# Altium schematic sheet USBDAC.SchDoc
size A3
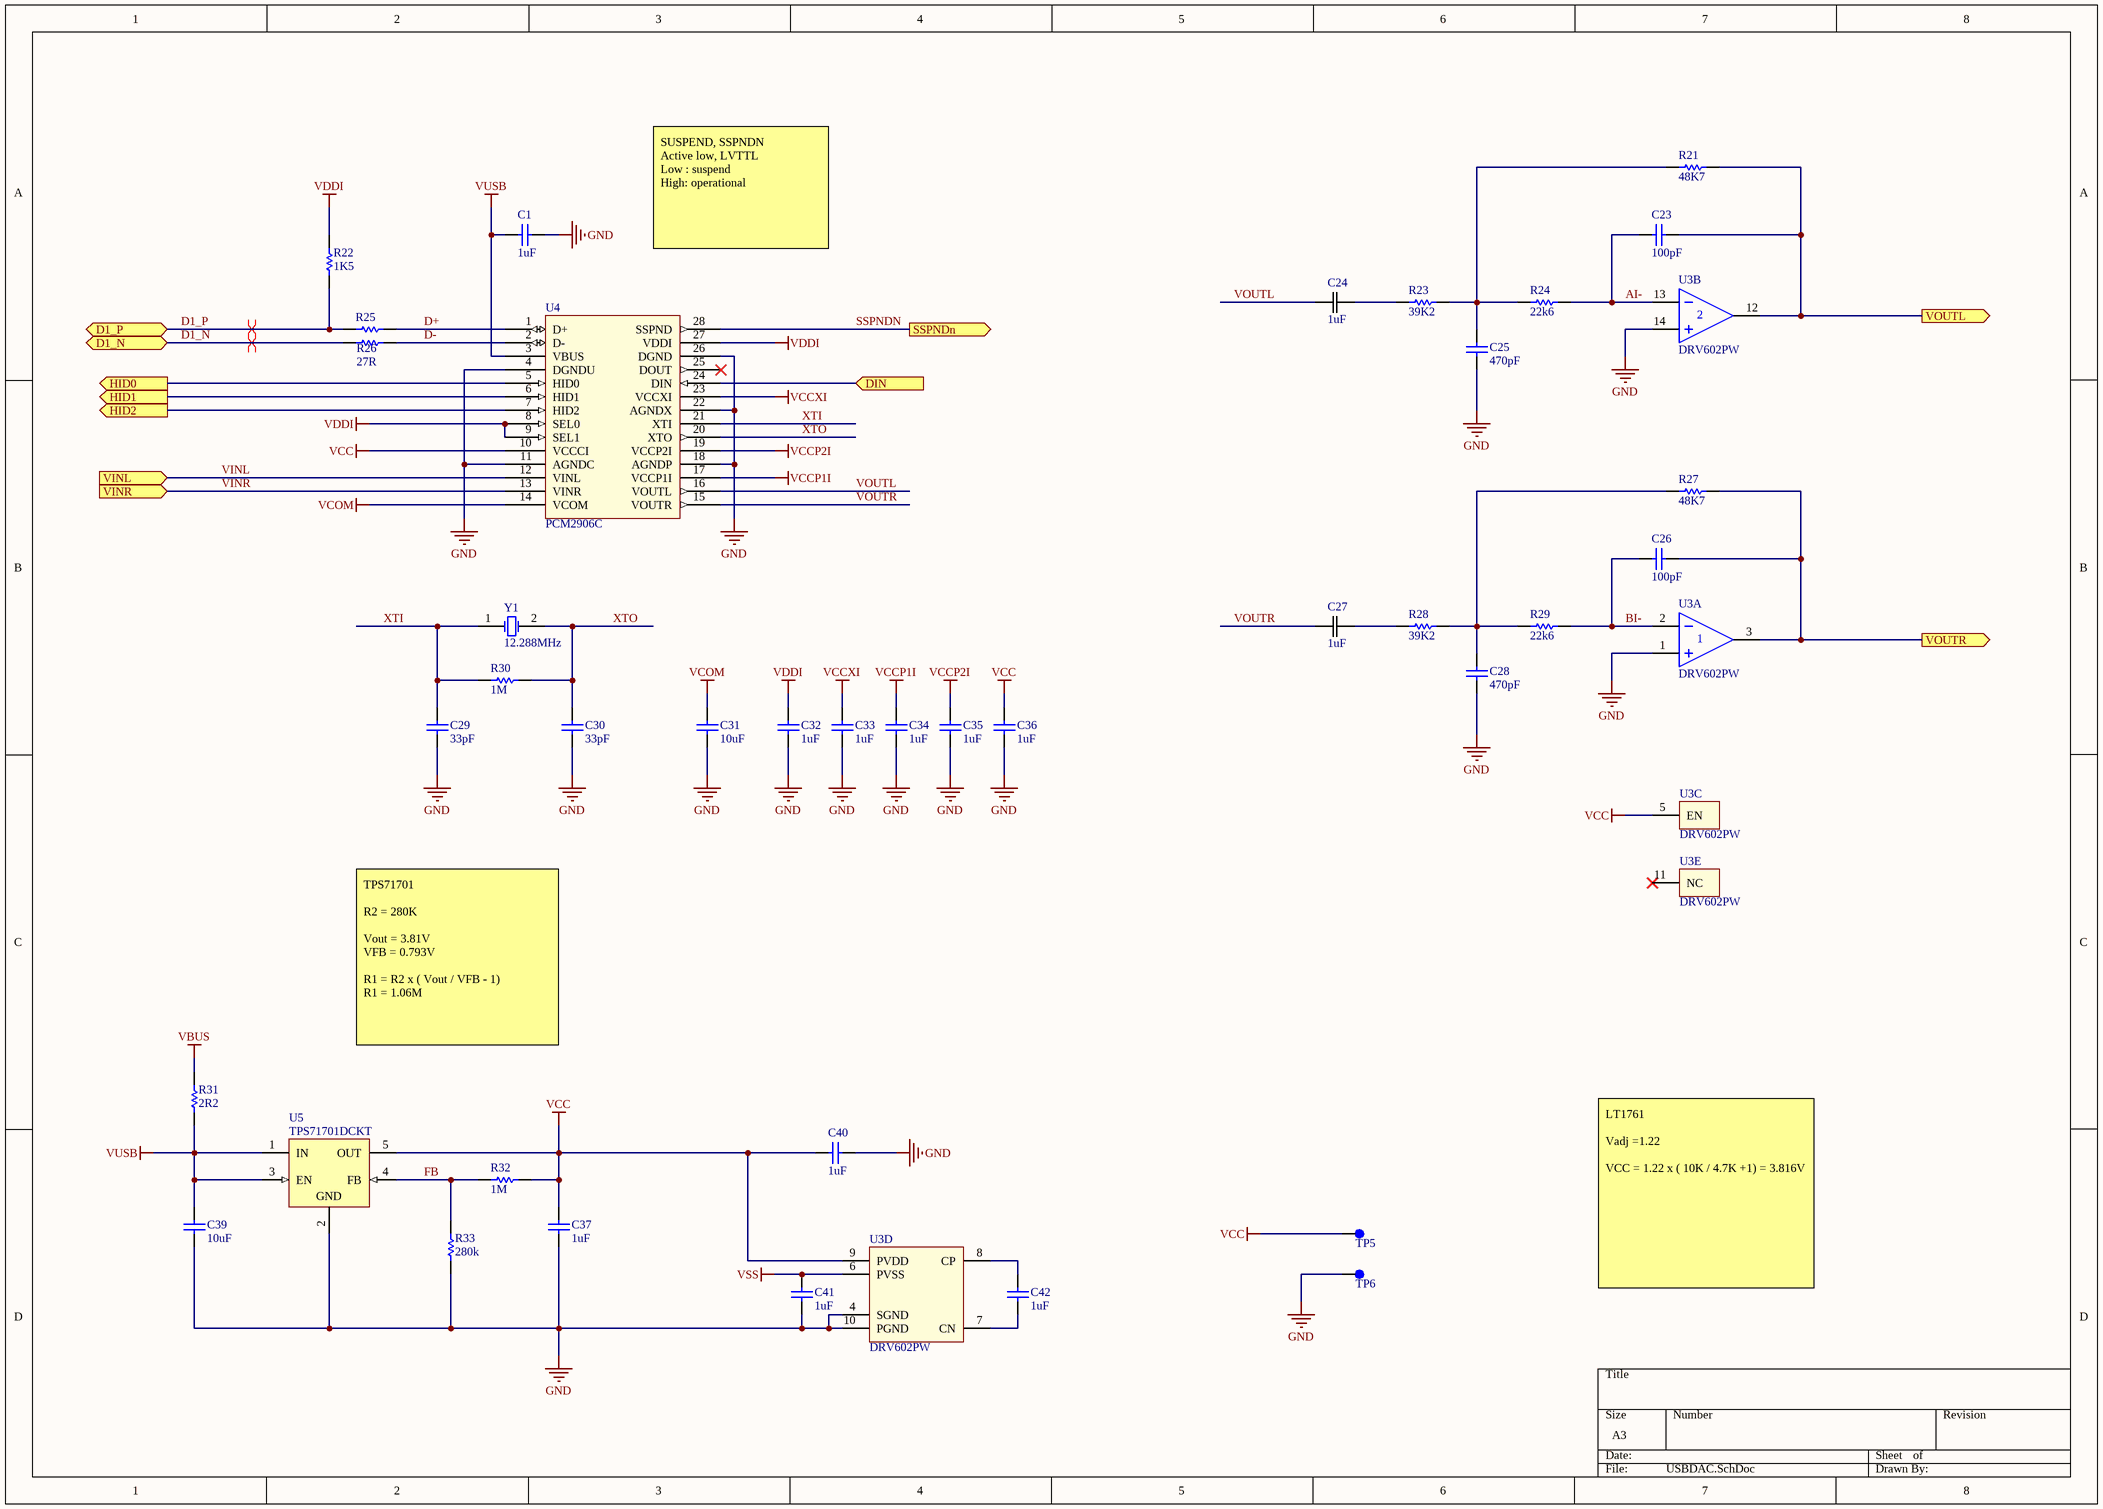
[diagram p0: USBDAC.SchDoc]

## Parts
C1  value 1uF  [CAPC0805(2012)145_N]  (hidden comment: CAP 1uF 16V 0805(2012))
C23  value 100pF  [CAPC0805(2012)75_N]  (hidden comment: CAP)
C24  1uF  [CAP_ECPU_G2]
C25  value 470pF  [CAPC0805(2012)75_N]  (hidden comment: CAP)
C26  value 100pF  [CAPC0805(2012)75_N]  (hidden comment: CAP)
C27  1uF  [CAP_ECPU_G2]
C28  value 470pF  [CAPC0805(2012)75_N]  (hidden comment: CAP)
C29  value 33pF  [CAPC0805(2012)100_N]  (hidden comment: CAP 33pF 16V 0805(2012))
C30  value 33pF  [CAPC0805(2012)100_N]  (hidden comment: CAP 33pF 16V 0805(2012))
C31  value 10uF  [CAPC0805(2012)145_N]  (hidden comment: CAP 10uF 16V 0805(2012))
C32  value 1uF  [CAPC0805(2012)145_N]  (hidden comment: CAP 1uF 16V 0805(2012))
C33  value 1uF  [CAPC0805(2012)145_N]  (hidden comment: CAP 1uF 16V 0805(2012))
C34  value 1uF  [CAPC0805(2012)145_N]  (hidden comment: CAP 1uF 16V 0805(2012))
C35  value 1uF  [CAPC0805(2012)145_N]  (hidden comment: CAP 1uF 16V 0805(2012))
C36  value 1uF  [CAPC0805(2012)145_N]  (hidden comment: CAP 1uF 16V 0805(2012))
C37  value 1uF  [CAPC0805(2012)145_N]  (hidden comment: CAP 1uF 16V 0805(2012))
C39  value 10uF  [CAPC0805(2012)145_N]  (hidden comment: CAP 10uF 16V 0805(2012))
C40  value 1uF  [CAPC0805(2012)145_N]  (hidden comment: CAP 1uF 16V 0805(2012))
C41  value 1uF  [CAPC0805(2012)145_N]  (hidden comment: CAP 1uF 16V 0805(2012))
C42  value 1uF  [CAPC0805(2012)145_L]  (hidden comment: CAP 1uF 16V 0805(2012))
R21  value 48K7  [RESC0805(2012)_N]  (hidden comment: 48K7 1% 0805(2012))
R22  value 1K5  [RESC0805(2012)_N]  (hidden comment: RES)
R23  value 39K2  [RESC0805(2012)_N]  (hidden comment: 39K2 1% 0805(2012))
R24  value 22k6  [RESC0805(2012)_N]  (hidden comment: 22K6 1% 0805(2012))
R25  RES  [RESC0402(1005)_L]  (value not drawn)
R26  value 27R  [RESC0402(1005)_L]  (hidden comment: RES)
R27  value 48K7  [RESC0805(2012)_N]  (hidden comment: 48K7 1% 0805(2012))
R28  value 39K2  [RESC0805(2012)_N]  (hidden comment: 39K2 1% 0805(2012))
R29  value 22k6  [RESC0805(2012)_N]  (hidden comment: 22K6 1% 0805(2012))
R30  value 1M  [RESC0603(1608)_N]  (hidden comment: RES)
R31  value 2R2  [RESC0805(2012)_N]  (hidden comment: 2R2 5% 0805(2012))
R32  value 1M  [RESC0805(2012)_L]  (hidden comment: 1M 1% 0805(2012))
R33  value 280k  [RESC0805(2012)_L]  (hidden comment: 280K 1% 0805(2012))
TP5  MECH_Testpoint  [MECH_TP_39_mil]  (value not drawn)
TP6  MECH_Testpoint  [MECH_TP_39_mil]  (value not drawn)
U3  DRV602PW  [TSSOP14_N]  (parts A,B,C,D,E of 5)
U4  PCM2906C  [SSOP28_N]
U5  TPS71701DCKT  [DCK0005A_L]
Y1  value 12.288MHz  [XTAL_SMD_5.0x3.2]  (hidden comment: ABM3-12.288MHZ-D2Y-T)

## Ports
D1_N (bidir), D1_P (bidir), DIN (in), HID0 (out), HID1 (out), HID2 (out), SSPNDn (out), VINL (in), VINR (in), VOUTL (out), VOUTR (out)

## Nets
GND: C1.1 C25.1 C28.1 C29.1 C30.1 C31.1 C32.1 C33.1 C34.1 C35.1 C36.1 C37.1 C39.1 C40.1 C41.1 R33.1 TP6.1(Pin1) U3.1(IN1+) U3.4(SGND) U3.10(PGND) U3.14(IN2+) U4.4(DGNDU) U4.11(AGNDC) U4.18(AGNDP) U4.22(AGNDX) U4.26(DGND) U5.2(GND)
VBUS: R31.2
VCC: C36.2 C37.2 C40.2 R32.2 TP5.1(Pin1) U3.5(EN) U3.9(PVDD) U4.10(VCCCI) U5.5(OUT)
VCCP1I: C34.2 U4.17(VCCP1I)
VCCP2I: C35.2 U4.19(VCCP2I)
VCCXI: C33.2 U4.23(VCCXI)
VCOM: C31.2 U4.14(VCOM)
VDDI: C32.2 R22.2 U4.8(SEL0) U4.9(SEL1) U4.27(VDDI)
VSS: C41.2 U3.6(PVSS)
VUSB: C1.2 C39.2 R31.1 U4.3(VBUS) U5.1(IN) U5.3(EN)
AI-: C23.2 R24.2 U3.13(IN2-)
BI-: C26.2 R29.2 U3.2(IN1-)
D1_N: R26.1 ; port D1_N
D1_P: R22.1 R25.1 ; port D1_P
D+: R25.2 U4.1(D+)
D-: R26.2 U4.2(D-)
DIN: U4.24(DIN) ; port DIN
FB: R32.1 R33.2 U5.4(FB)
HID0: U4.5(HID0) ; port HID0
HID1: U4.6(HID1) ; port HID1
HID2: U4.7(HID2) ; port HID2
SSPNDN: U4.28(SSPND) ; port SSPNDn
VINL: U4.12(VINL) ; port VINL
VINR: U4.13(VINR) ; port VINR
VOUTL: C23.1 R21.1 U3.12(OUT2) ; port VOUTL
VOUTL: C24.1 U4.16(VOUTL)  [a separate net that carries the same name]
VOUTR: C26.1 R27.1 U3.3(OUT1) ; port VOUTR
VOUTR: C27.1 U4.15(VOUTR)  [a separate net that carries the same name]
XTI: C29.2 R30.1 U4.21(XTI) Y1.1(OSC1)
XTO: C30.2 R30.2 U4.20(XTO) Y1.2(OSC2)
NetC24_2: C24.2 R23.2
NetC25_2: C25.2 R21.2 R23.1 R24.1
NetC27_2: C27.2 R28.2
NetC28_2: C28.2 R27.2 R28.1 R29.1
NetC42_1: C42.1 U3.7(CN)
NetC42_2: C42.2 U3.8(CP)

Not connected (* = marked no-connect by the designer): U3 11(NC)*; U4 25(DOUT)*

## Layout directives
differential pair: D1_N, D1_P

## Notes on the sheet
- SUSPEND, SSPNDN
  Active low, LVTTL
  Low : suspend
  High: operational
- TPS71701
  R2 = 280K
  Vout = 3.81V
  VFB = 0.793V
  R1 = R2 x ( Vout / VFB - 1)
  R1 = 1.06M
- LT1761
  Vadj =1.22
  VCC = 1.22 x ( 10K / 4.7K +1) = 3.816V

## Library data of the parts
C1 C32-C37 C40-C42 = CMP-1036-04748-1: CAP 1uF 16V ±20% 0805 (2012 Metric) Thickness 1.45mm SMD; Tolerance: Â±20%; Case-Metric: 2012; Case-EIA: 0805; Technology: SMT; Rated Voltage: 16 V; Max Thickness: 1.45 mm
C23 C25 C26 C28 = CAP: Generic capacitor non polarised
C24 C27 = CAP-ECP-U1C105MA5: 1µF Film Capacitor  16V Acrylic, Metallized - Stacked 1210 (3225 Metric); Vendor: Panasonic; Built_By: EMA_UL_Team; Type: DEV; C: Copyright (C) 2015 Accelerated Designs. All rights reserved; MPN: ECP-U1C105MA5; RefDes: RefDes; Value: 1uF
C29 C30 = CMP-1036-01404-1: CAP 33pF 16V ±1% 0805 (2012 Metric) Thickness 1mm SMD; Case-Metric: 2012; Case-EIA: 0805; Tolerance: Â±1%; Max Thickness: 1 mm; Technology: SMT; Rated Voltage: 16 V
C31 C39 = CMP-1036-04929-1: CAP 10uF 16V ±20% 0805 (2012 Metric) Thickness 1.45mm SMD; Tolerance: Â±20%; Case-EIA: 0805; Case-Metric: 2012; Rated Voltage: 16 V; Technology: SMT; Max Thickness: 1.45 mm
R21 R27 = CMP-1013-00701-1: 48K7 0.125W 1% 0805 (2012 Metric)  SMD; Case-Metric: 2012; Case-EIA: 0805; Tolerance: 1 %; Power: 0.125 W; Technology: SMT
R22 R26 R30 = RES: Generic resistor
R23 R28 = CMP-1013-00690-1: 39K2 0.125W 1% 0805 (2012 Metric)  SMD; Case-Metric: 2012; Case-EIA: 0805; Power: 0.125 W; Tolerance: 1 %; Technology: SMT
R24 R29 = CMP-1013-00661-1: 22K6 0.125W 1% 0805 (2012 Metric)  SMD; Case-Metric: 2012; Case-EIA: 0805; Tolerance: 1 %; Technology: SMT; Power: 0.125 W
R25 = RES: Generic resistor; Value: 27R
R31 = CMP-1013-00010-1: 2R2 0.125W 5% 0805 (2012 Metric)  SMD; Case-Metric: 2012; Case-EIA: 0805; Technology: SMT; Tolerance: 5 %; Power: 0.125 W
R32 = CMP-1013-00849-1: 1M 0.125W 1% 0805 (2012 Metric)  SMD; Case-Metric: 2012; Case-EIA: 0805; Technology: SMT; Power: 0.125 W; Tolerance: 1 %
R33 = CMP-1013-00785-1: 280K 0.125W 1% 0805 (2012 Metric)  SMD; Case-EIA: 0805; Case-Metric: 2012; Tolerance: 1 %; Power: 0.125 W; Technology: SMT
TP5 TP6 = MECH_Testpoint: Testpoint
U3 = IC-LINEAR-DRV602PW: Amplifier IC 2-Channel (Stereo) Class AB 14-TSSOP; Farnell: 1710798; MPN: DRV602PW; DigiKey: 296-24081-1-ND
U4 = IC-AUDIO-PCM2906C: IC STEREO AUD CODEC W/USB 28SSOP
U5 = CMP-0394-00856-2: Single Output LDO, 150 mA, Adjustable 0.9 to 6.2 V Output, 2.5 to 6.5 V Input, with High-Bandwidth PSRR, 5-pin SC70 (DCK), -40 to 125 degC, Green (RoHS & no Sb/Br); Manufacturer: Texas Instruments; Vin(Max)(V): 6.5; Iq(Typ)(mA): 0.05; Vdo(Typ)(mV): 170; Vout Adj(Min)(V): 0.9; Accuracy(%): 3; Iout(Max)(A): 0.15; Vout Adj(Max)(V): 6.2; Vin(Min)(V): 2.5; SubFamily: Single Channel LDO; PackageVersion: 4093553-3/G; Code_JEDEC: MO-203; ComponentLink2Description: Datasheet; ComponentLink1URL: http://www.ti.com/; ComponentLink3Description: Package Specification; ComponentLink2URL: http://www.ti.com/general/docs/lit/getliterature.tsp?genericPartNumber=TPS71701&fileType=pdf; PartNumber: TPS71701DCKT; Eco-Plan: Green (RoHS & no Sb/Br); Mounting Technology: Surface Mount; ComponentLink1Description: Manufacturer URL; ComponentLink3URL: http://www.ti.com/litv/pdf/mpds025f; PackageDescription: 5-Pin Plastic Small-Outline, Body 2 x 1.25 mm, Pitch 0.65 mm; PackageReference: DCK0005A; DatasheetVersion: SBVS068G
Y1 = XTAL_12.288MHz_ABM3-12.288MHZ-D2Y-T: CRYSTAL 12.288MHZ 18PF SMD; Farnell: 1368769; MPN: ABM3-12.288MHZ-D2Y-T; DigiKey: 535-10635-1-ND